# EAGLE design CompletePCBV4 (EAGLE 9.2.1)
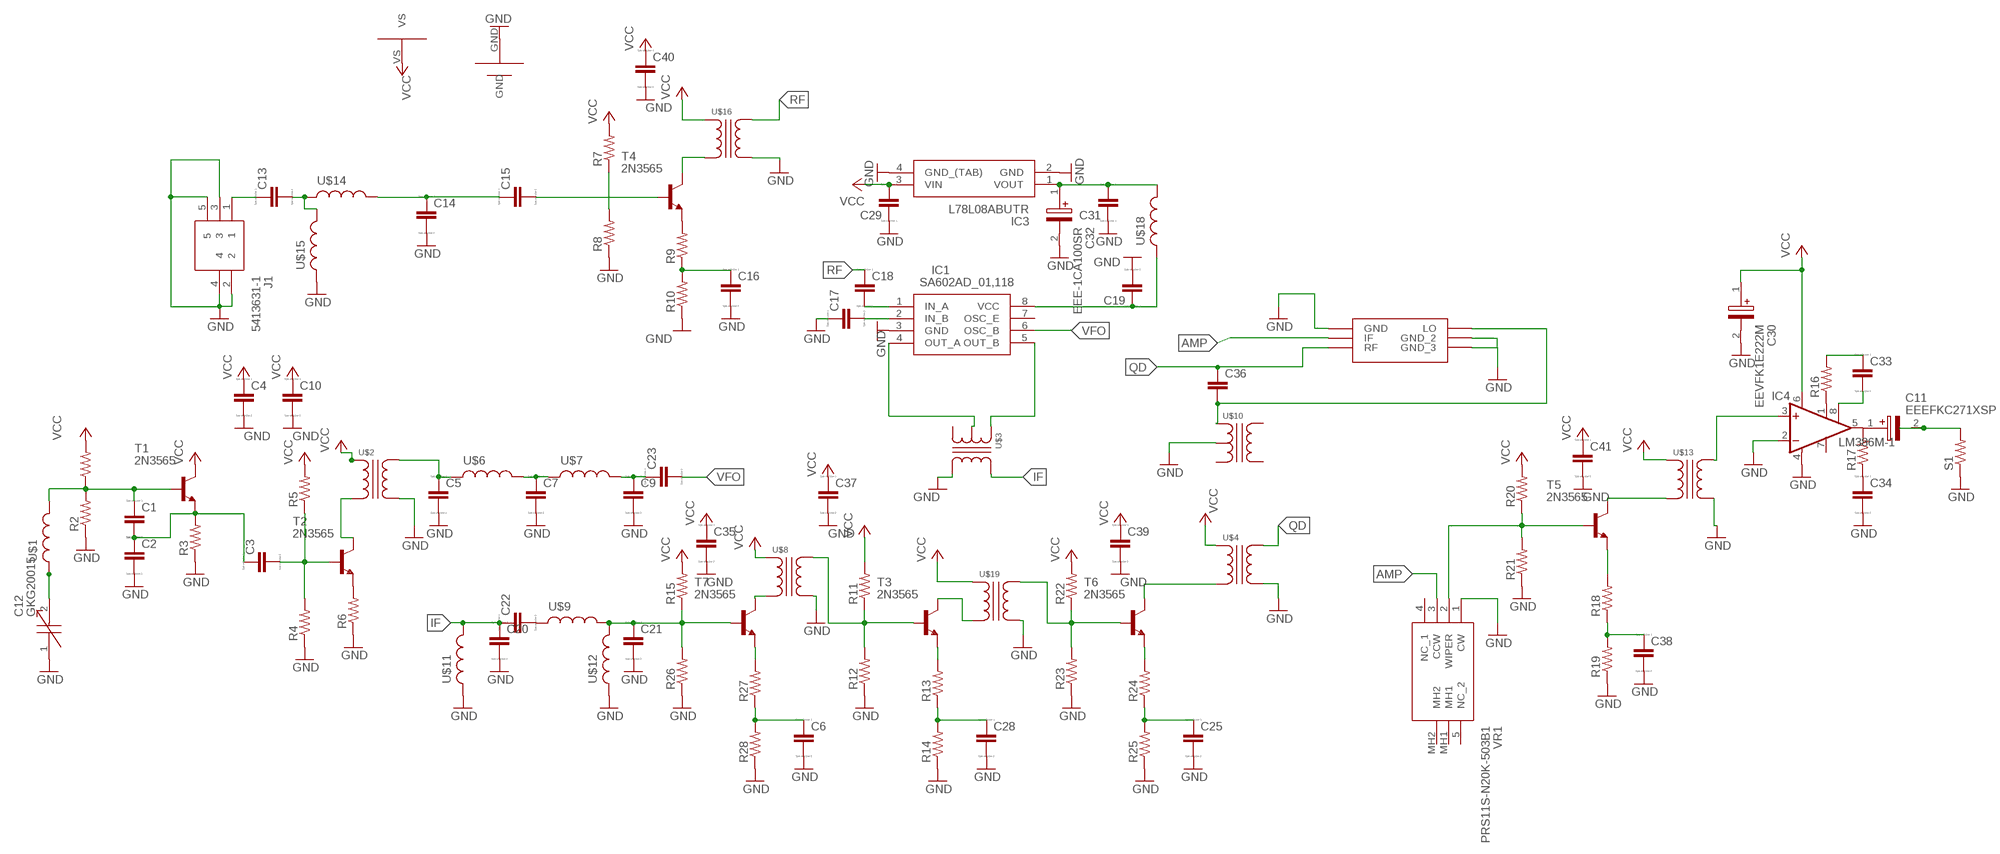
[diagram p0: schematic, sheet 1]

## Parts
C1  C  [C0805]
C2  C  [C0805]
C3  C  [C0805]
C4  C  [C0805]
C5  C  [C0805]
C6  C  [C0805]
C7  C  [C0805]
C9  C  [C0805]
C10  C  [C0805]
C11  EEEFKC271XSP  [FKSV(D8)]
C12  GKG20015  [GKG20015]
C13  C  [C0805]
C14  C  [C0805]
C15  C  [C0805]
C16  C  [C0805]
C17  C  [C0805]
C18  C  [C0805]
C19  C  [C0805]
C20  C  [C0805]
C21  C  [C0805]
C22  C  [C0805]
C23  C  [C0805]
C25  C  [C0805]
C28  C  [C0805]
C29  C  [C0805]
C30  EEVFK1E222M  [FKV(J16)]
C31  C  [C0805]
C32  EEE-1CA100SR  [SV(B)]
C33  C  [C0805]
C34  CC1206  [C1206]
C35  C  [C0805]
C36  C-EUC0805  [C0805]
C37  C  [C0805]
C38  C  [C0805]
C39  C  [C0805]
C40  C  [C0805]
C41  C  [C0805]
IC1  SA602AD_01,118  [SOIC127P600X175-8N]
IC3  L78L08ABUTR  [ST-SOT-89]
IC4  LM386M-1  [SO08]
J1  5413631-1  [54136311]
R1  R-US_R0805  [R0805]
R2  R-US_R0805  [R0805]
R3  R-US_R0805  [R0805]
R4  R-US_R0805  [R0805]
R5  R-US_R0805  [R0805]
R6  R-US_R0805  [R0805]
R7  R-US_R0805  [R0805]
R8  R-US_R0805  [R0805]
R9  R-US_R0805  [R0805]
R10  R-US_R0805  [R0805]
R11  R-US_R0805  [R0805]
R12  R-US_R0805  [R0805]
R13  R-US_R0805  [R0805]
R14  R-US_R0805  [R0805]
R15  R-US_R0805  [R0805]
R16  R-US_R0805  [R0805]
R17  R-US_R0805  [R0805]
R18  R-US_R0805  [R0805]
R19  R-US_R0805  [R0805]
R20  R-US_R0805  [R0805]
R21  R-US_R0805  [R0805]
R22  R-US_R0805  [R0805]
R23  R-US_R0805  [R0805]
R24  R-US_R0805  [R0805]
R25  R-US_R0805  [R0805]
R26  R-US_R0805  [R0805]
R27  R-US_R0805  [R0805]
R28  R-US_R0805  [R0805]
S1  R-US_0207/5V  [0207/5V]
T1  2N3565  [TO92]
T2  2N3565  [TO92]
T3  2N3565  [TO92]
T4  2N3565  [TO92]
T5  2N3565  [TO92]
T6  2N3565  [TO92]
T7  2N3565  [TO92]
U$1  WOUNDINDUCTOR  [WOUNDINDUCTOR]
U$2  RFTRANSFORMER  [RFTRABSFORMER]
U$3  42IF123  [42IF123]
U$4  RFTRANSFORMER  [RFTRABSFORMER]
U$5  ALLIGATORCLIPS  [ALLIGATORCONNECTOR]
U$6  WOUNDINDUCTOR  [WOUNDINDUCTOR]
U$7  WOUNDINDUCTOR  [WOUNDINDUCTOR]
U$8  RFTRANSFORMER  [RFTRABSFORMER]
U$9  WOUNDINDUCTOR  [WOUNDINDUCTOR]
U$10  42IF123  [42IF123]
U$11  WOUNDINDUCTOR  [WOUNDINDUCTOR]
U$12  WOUNDINDUCTOR  [WOUNDINDUCTOR]
U$13  RFTRANSFORMER  [RFTRABSFORMER]
U$14  WOUNDINDUCTOR  [WOUNDINDUCTOR]
U$15  WOUNDINDUCTOR  [WOUNDINDUCTOR]
U$16  RFTRANSFORMER  [RFTRABSFORMER]
U$17  ADE-1  [ADE-1]
U$18  WOUNDINDUCTOR  [WOUNDINDUCTOR]
U$19  RFTRANSFORMER  [RFTRABSFORMER]
VR1  PRS11S-N20K-503B1  [PRS11SN20K503B1]

## Nets
AMP: U$17.IF VR1.3(CCW)
GND: C2.2 C4.2 C5.2 C6.2 C7.2 C9.2 C10.2 C12.1 C14.2 C16.2 C17.1 C19.2 C20.2 C21.2 C25.2 C28.2 C29.1 C30.2(-) C31.1 C32.2(-) C34.2 C35.2 C37.2 C38.2 C39.2 C40.2 C41.2 IC1.3(GND) IC3.2(GND) IC3.4(GND_(TAB)) IC4.2(-IN) IC4.4(GND) J1.2 J1.3 J1.4 J1.5 R2.1 R3.1 R4.1 R6.1 R8.1 R10.1 R12.1 R14.1 R19.1 R21.1 R23.1 R25.1 R26.1 R28.1 S1.1 U$2.P$4 U$3.P$4 U$4.P$4 U$5.GND U$8.P$4 U$10.P$1 U$11.1 U$12.1 U$13.P$4 U$15.1 U$16.P$4 U$17.GND U$17.GND2(GND_2) U$17.GND3(GND_3) U$19.P$4 VR1.1(CW)
IF: C20.1 C22.1 U$3.P$5 U$11.2
N$1: R6.2 T2.3(E)
N$2: T7.1(C) U$8.P$2
N$3: C1.2 C2.1 C3.1 R3.2 T1.3(E)
N$4: C1.1 R1.1 R2.2 T1.2(B) U$1.2
N$5: C3.2 R4.2 R5.1 T2.2(B)
N$6: R22.1 R23.2 T6.2(B) U$19.P$3
N$7: C22.2 U$9.1
N$8: C5.1 U$2.P$3 U$6.1
N$9: R9.2 T4.3(E)
N$10: C7.1 U$6.2 U$7.1
N$11: T2.1(C) U$2.P$2
N$12: C12.2 U$1.1
N$13: C9.1 C23.1 U$7.2
N$14: C16.1 R9.1 R10.2
N$15: C13.1 J1.1
N$16: C14.1 C15.1 U$14.2
N$17: C15.2 T4.2(B)
N$18: R7.1 R8.2
N$19: T4.1(C) U$16.P$2
N$20: IC1.5(OUT_B) U$3.P$2
N$21: IC1.4(OUT_A) U$3.P$1
N$22: C28.1 R13.1 R14.2
N$23: C17.2 IC1.2(IN_B)
N$24: C18.2 IC1.1(IN_A)
N$26: T6.1(C) U$4.P$2
N$27: C36.2 U$10.P$2 U$17.LO
N$28: R20.1 R21.2 T5.2(B) VR1.2(WIPER)
N$29: R18.2 T5.3(E)
N$30: C38.1 R18.1 R19.2
N$31: R11.1 R12.2 T3.2(B) U$8.P$3
N$32: T5.1(C) U$13.P$2
N$33: T3.1(C) U$19.P$2
N$34: C19.1 IC1.8(VCC) U$18.1
N$35: IC4.3(+IN) U$13.P$3
N$36: C13.2 U$14.1 U$15.2
N$37: R24.2 T6.3(E)
N$38: C25.1 R24.1 R25.2
N$39: R13.2 T3.3(E)
N$40: IC4.1(GAIN) R16.1
N$41: C11.1(+) IC4.5(OUT) R17.2
N$42: C34.1 R17.1
N$43: C21.1 R15.1 R26.2 T7.2(B) U$9.2 U$12.2
N$44: C33.1 R16.2
N$45: C33.2 IC4.8(GAIN)
N$46: C11.2(-) S1.2
N$47: C31.2 C32.1(+) IC3.1(VOUT) U$18.2
N$49: C6.1 R27.1 R28.2
N$50: R27.2 T7.3(E)
QD: C36.1 U$4.P$3 U$17.RF
RF: C18.1 U$16.P$3
VCC: C4.1 C10.1 C29.2 C30.1(+) C35.1 C37.1 C39.1 C40.1 C41.1 IC3.3(VIN) IC4.6(VS) R1.2 R5.2 R7.2 R11.2 R15.2 R20.2 R22.2 T1.1(C) U$2.P$1 U$4.P$1 U$5.VS U$8.P$1 U$13.P$1 U$16.P$1 U$19.P$1
VFO: C23.2 IC1.6(OSC_B)
Unconnected: IC1.7(OSC_E) IC4.7(BYPASS) U$3.P$3 U$10.P$3 U$10.P$4 U$10.P$5 VR1.4(NC_1) VR1.5(NC_2) VR1.MH1 VR1.MH2

## Library data of the parts
C1-C7 C9 C10 C13-C23 C25 C28 C29 C31 C33-C35 C37-C41 = eagle-ltspice:C: CAPACITOR, European symbol; SPICEMODEL: NONE; SPICEPREFIX: C
C11 = SamacSys_Parts:EEEFKC271XSP: Panasonic 270uF 16 V dc Aluminium Electrolytic Capacitor, FKS Series 2000h 6.3 (Dia.) x 7.7mm Source: Datasheet <https://industrial.panasonic.com/cdbs/www-data/pdf/RDE0000/ABA0000C569.pdf>; DESCRIPTION: Panasonic 270uF 16 V dc Aluminium Electrolytic Capacitor, FKS Series 2000h 6.3 (Dia.) x 7.7mm; HEIGHT: mm; MANUFACTURER_NAME: Panasonic; MANUFACTURER_PART_NUMBER: EEEFKC271XSP
C12 = SamacSys_Parts:GKG20015: Trimmer / Variable Capacitors 5-20pF 100V 85 DEG Source: Datasheet <http://www.mouser.com/datasheet/2/384/659305J-1204018.pdf>; DESCRIPTION: Trimmer / Variable Capacitors 5-20pF 100V 85 DEG; HEIGHT: 5.1mm; MANUFACTURER_NAME: Sprague Goodman; MANUFACTURER_PART_NUMBER: GKG20015; MOUSER_PART_NUMBER: 659-GKG20015; MOUSER_PRICE-STOCK: https://www.mouser.com/Search/Refine.aspx?Keyword=659-GKG20015
C30 = SamacSys_Parts:EEVFK1E222M: Ecap 2200uF 25V J16 Case FK SMD Panasonic Aluminium Electrolytic Capacitor 2200uF 25 V dc 16mm Surface Mount series FK SMD lifetime 5000h Source: Datasheet <https://industrial.panasonic.com/cdbs/www-data/pdf/RDE0000/ABA0000C1181.pdf>; DESCRIPTION: Ecap 2200uF 25V J16 Case FK SMD Panasonic Aluminium Electrolytic Capacitor 2200uF 25 V dc 16mm Surface Mount series FK SMD lifetime 5000h; HEIGHT: mm; MANUFACTURER_NAME: Panasonic; MANUFACTURER_PART_NUMBER: EEVFK1E222M
C32 = SamacSys_Parts:EEE-1CA100SR: Aluminum Electrolytic Capacitors - SMD 10uF 16V Source: Datasheet <https://componentsearchengine.com/Datasheets/1/EEE-1CA100SR.pdf>; DESCRIPTION: Aluminum Electrolytic Capacitors - SMD 10uF 16V; HEIGHT: mm; MANUFACTURER_NAME: Panasonic; MANUFACTURER_PART_NUMBER: EEE-1CA100SR; MOUSER_PART_NUMBER: 667-EEE-1CA100SR; MOUSER_PRICE-STOCK: https://www.mouser.com/Search/Refine.aspx?Keyword=667-EEE-1CA100SR
C36 = rcl:C-EU: CAPACITOR, European symbol; SPICEPREFIX: C
IC1 = SamacSys_Parts:SA602AD_01,118: NXP - SA602AD/01,118 - DOUBLE-BALANCED MIXER, 500MHZ, SOIC-8 Source: Datasheet <https://www.mouser.com/datasheet/2/302/SA602A-1127653.pdf>; DESCRIPTION: NXP - SA602AD/01,118 - DOUBLE-BALANCED MIXER, 500MHZ, SOIC-8; HEIGHT: 1.75mm; MANUFACTURER_NAME: NXP; MANUFACTURER_PART_NUMBER: SA602AD/01,118; MOUSER_PART_NUMBER: 771-SA602AD/01-T
IC3 = SamacSys_Parts:L78L08ABUTR: L78L08ABUTR, Voltage Regulator, 0.1A 8 V, 4-Pin SOT-89 Source: Datasheet <https://componentsearchengine.com/Datasheets/1/L78L08ABUTR.pdf>; DESCRIPTION: L78L08ABUTR, Voltage Regulator, 0.1A 8 V, 4-Pin SOT-89; HEIGHT: mm; MANUFACTURER_NAME: STMicroelectronics; MANUFACTURER_PART_NUMBER: L78L08ABUTR; MOUSER_PART_NUMBER: 511-L78L08ABU; MOUSER_PRICE-STOCK: https://www.mouser.com/Search/Refine.aspx?Keyword=511-L78L08ABU
IC4 = linear:LM386?-*: Low Voltage Audio Power Amplifier Source: http://cache.national.com/ds/LM/LM386.pdf
J1 = SamacSys_Parts:5413631-1: TE Connectivity Right Angle 50 Through Hole BNC Connector, jack, Nickel, Solder Termination Source: Datasheet <https://componentsearchengine.com/Datasheets/1/5413631-1.pdf>; DESCRIPTION: TE Connectivity Right Angle 50 Through Hole BNC Connector, jack, Nickel, Solder Termination; HEIGHT: 11.15mm; MANUFACTURER_NAME: TE Connectivity; MANUFACTURER_PART_NUMBER: 5413631-1; MOUSER_PART_NUMBER: 571-5413631-1; MOUSER_PRICE-STOCK: https://www.mouser.com/Search/Refine.aspx?Keyword=571-5413631-1
R1-R28 = resistor:R-US_: RESISTOR, American symbol
S1 = rcl:R-US_: RESISTOR, American symbol; SPICEPREFIX: R
T1-T7 = transistor:2N3565: NPN TRANSISTOR
U$1 U$6 U$7 U$9 U$11 U$12 U$14 U$15 U$18 = Custom:WOUNDINDUCTOR
U$2 U$4 U$8 U$13 U$16 U$19 = Custom:RFTRANSFORMER
U$3 U$10 = Custom:42IF123
U$5 = Custom:ALLIGATORCLIPS
U$17 = Custom:ADE-1
VR1 = SamacSys_Parts:PRS11S-N20K-503B1: Res Carbon Film POT 50K Ohm 20% 0.05W(1/20W) 1(Elec)/1(Mech)Turn 6mm (11.7 X 18.5 X 21.4mm) Gull Wing SMD Tube Source: Datasheet <https://componentsearchengine.com/Datasheets/1/PRS11S-N20K-503B1.pdf>; DESCRIPTION: Res Carbon Film POT 50K Ohm 20% 0.05W(1/20W) 1(Elec)/1(Mech)Turn 6mm (11.7 X 18.5 X 21.4mm) Gull Wing SMD Tube; HEIGHT: 20mm; MANUFACTURER_NAME: Bourns; MANUFACTURER_PART_NUMBER: PRS11S-N20K-503B1; MOUSER_PART_NUMBER: 652-PRS11SN20K503B1; MOUSER_PRICE-STOCK: https://www.mouser.com/Search/Refine.aspx?Keyword=652-PRS11SN20K503B1

## Net classes
0 default: width 0.762 mm
1 POWER: width 0.381 mm
2 RF: width 0.635 mm
3 VCC: width 0.889 mm

## Board
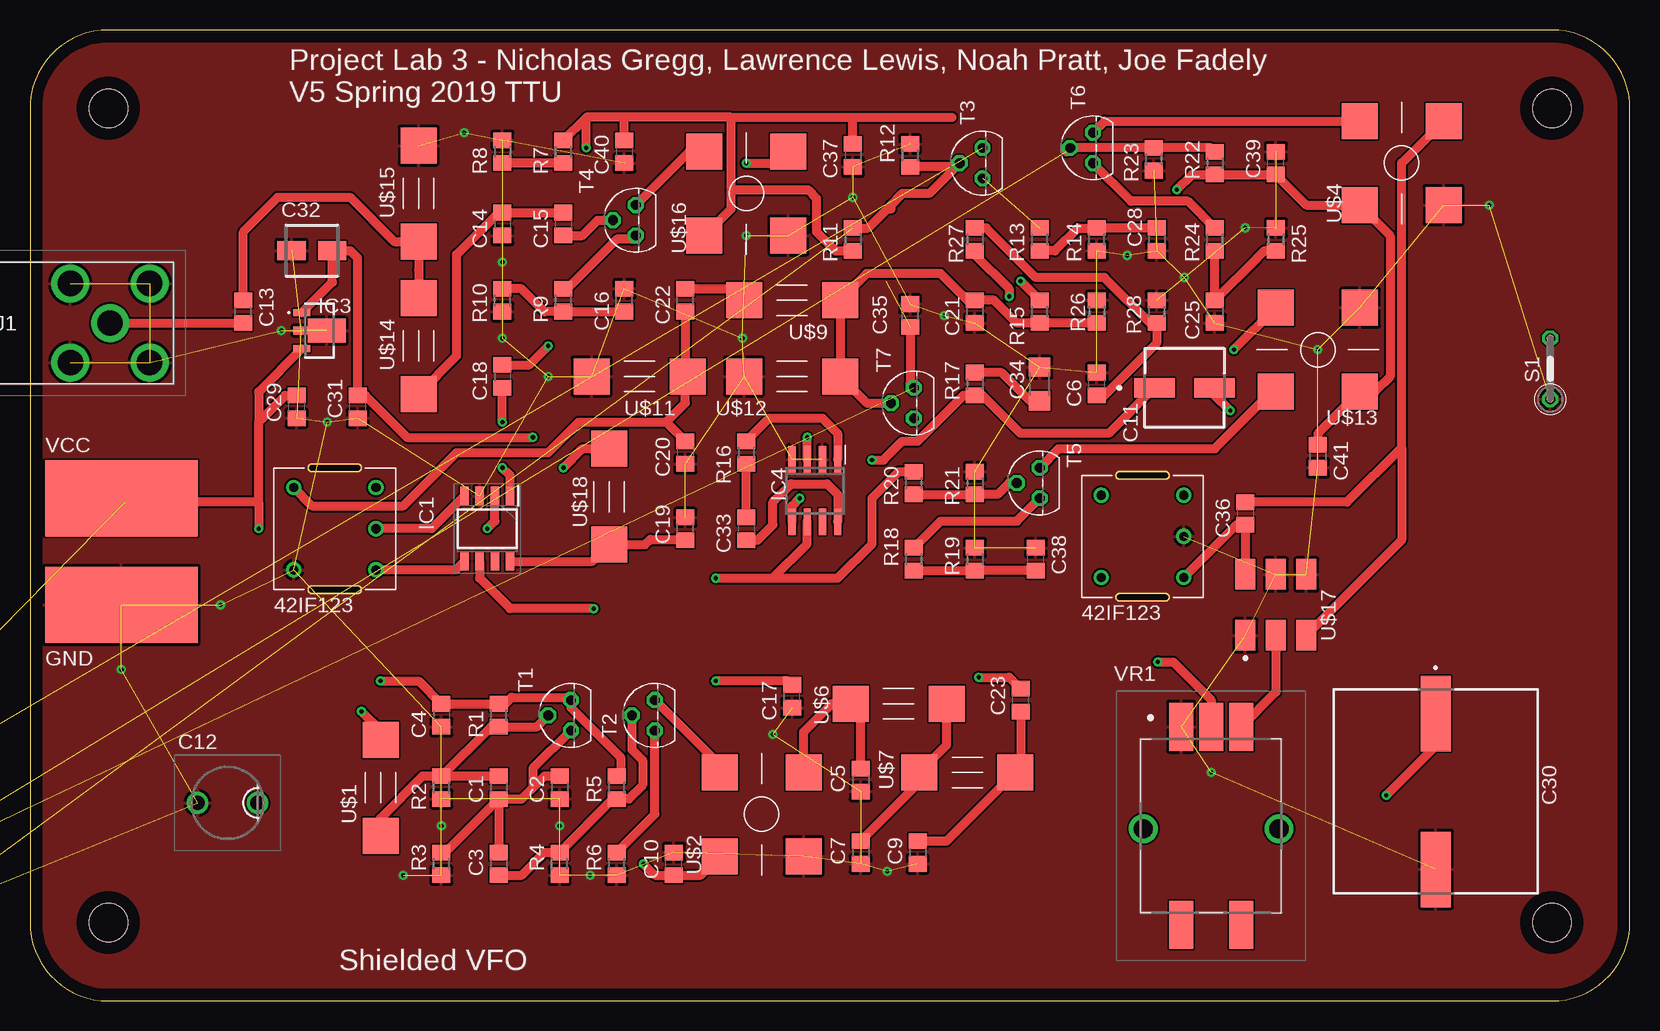
[diagram p1: board, top side]
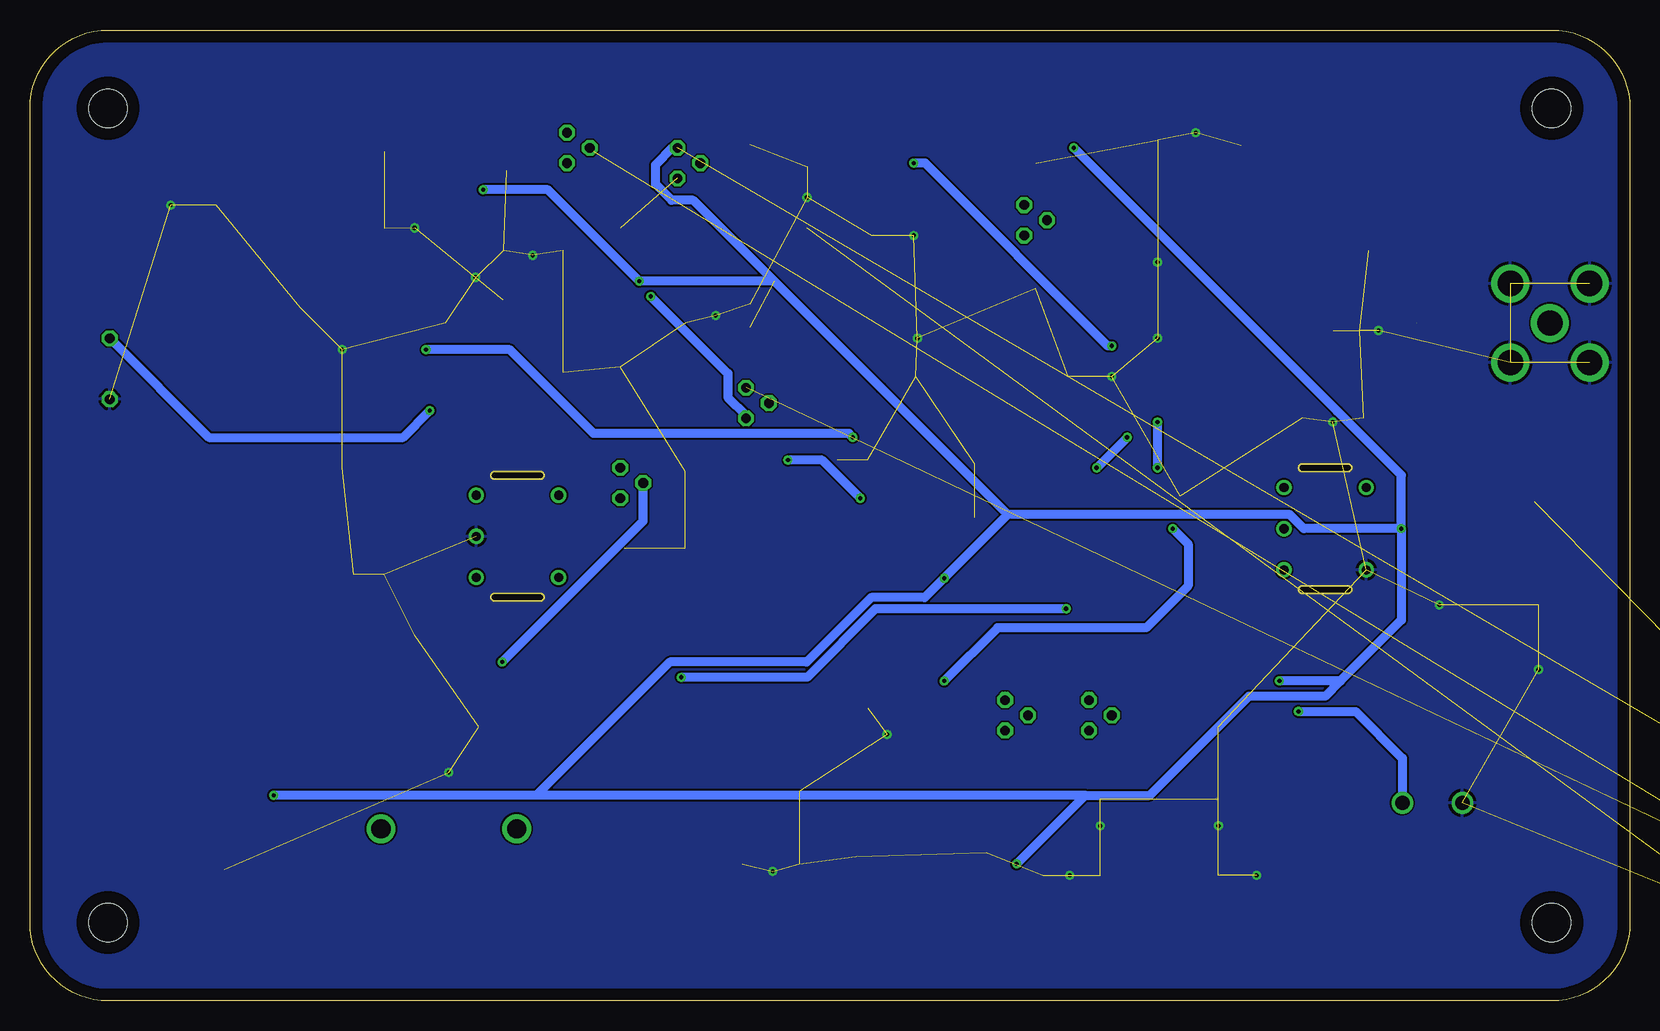
[diagram p2: board, bottom side, seen from below]

Size 133.33 x 80.95 mm. Coordinates in mm from the lower left corner, seen from the top.
Outline: 0,74.42 0,6.53 arc90 6.53,0 126.8,0 arc90 133.33,6.53 133.33,74.42 arc90 126.8,80.95 6.53,80.95 arc90 0,74.42
Copper layers (1*16): Top 0.035mm / dielectric 1.5mm / Bottom 0.035mm
Design rules "default": minimum track width 6mil, minimum drill 0.35mm, track to track 6mil, track to pad 6mil, pad to pad 6mil, via to via 6mil, smd to smd 6mil, copper to edge 40mil, drill to drill 6mil, minimum pad ring 10mil, minimum via ring 8mil, stop-mask expansion 4mil, vias tented up to drill 0mil, thermal gap 10mil
Holes 3.2 mm at 6.53,74.42 126.82,74.42 126.82,6.53 6.53,6.53

### Footprints (pad centres in the part's own frame; a part is rotated, then mirrored left to right if it is on the bottom)
C0805 = smd 1.3 x 1.5: 1 -0.95,0; 2 0.95,0
FKSV(D8) = smd 3.4 x 1.6: 1 -2.5,0; 2 2.5,0
GKG20015 = drill 1.2 pad 1.8: 1 0,0; 2 5,0
FKV(J16) = smd 6.3 x 2.5: 1 -6.5,0; 2 6.5,0
SV(B) = smd 2.35 x 1.6: 1 -1.7,0; 2 1.7,0
C1206 = smd 1.6 x 1.8: 1 -1.4,0; 2 1.4,0
SOIC127P600X175-8N = smd 1.55 x 0.7: 1 -2.725,1.905; 2 -2.725,0.635; 3 -2.725,-0.635; 4 -2.725,-1.905; 5 2.725,-1.905; 6 2.725,-0.635; 7 2.725,0.635; 8 2.725,1.905
ST-SOT-89 = smd 0.57 x 1.4: 1 -1.5,-1.475; 3 1.5,-1.475 | smd 0.65 x 1.2: 2 0,-1.575 | smd 2 x 3.15: 4 0,0.6
SO08 = smd 0.6 x 2.2: 1 -1.905,-2.6; 2 -0.635,-2.6; 3 0.635,-2.6; 4 1.905,-2.6; 5 1.905,2.6; 6 0.635,2.6; 7 -0.635,2.6; 8 -1.905,2.6
54136311 = drill 2.11 pad 3.165: 1 0,0; 2 -3.3,3.3; 3 -3.3,-3.3; 4 3.3,-3.3; 5 3.3,3.3
R0805 = smd 1.3 x 1.5: 1 -0.95,0; 2 0.95,0
0207/5V = drill 0.813 octagon: 1 -2.54,0; 2 2.54,0
TO92 = drill 0.813 octagon: 1 1.27,0; 2 0,1.905; 3 -1.27,0
WOUNDINDUCTOR = smd 3 x 3: 1 0,4; 2 0,-4
RFTRABSFORMER = smd 3 x 3: P$1 -3.5,3.5; P$2 3.5,3.5; P$3 3.5,-3.5; P$4 -3.5,-3.5
42IF123 = drill 0.762: P$1 -3.429,0; P$2 -3.429,3.429; P$3 -3.429,-3.429; P$4 3.429,3.429; P$5 3.429,-3.429
ALLIGATORCONNECTOR = smd 6.35 x 12.7: GND 7.62,2.54; VS -1.27,2.54
ADE-1 = smd 1.65 x 2.54: GND -2.54,-2.54; GND2 0,2.54; GND3 2.54,2.54; IF 0,-2.54; LO -2.54,2.54; RF 2.54,-2.54
PRS11SN20K503B1 = smd 2 x 4: 1 2.5,-8.25; 2 0,-8.25; 3 -2.5,-8.25; 4 -2.5,8.25; 5 2.5,8.25 | drill 1.6 pad 2.4: MH1 -5.65,0.25; MH2 5.65,0.25

### Placement (x,y rotation side)
C1  39.05,17.78 270 top
C2  44.13,17.78 270 top
C3  39.05,11.43 270 top
C4  34.29,23.81 270 top
C5  69.22,18.41 270 top
C6  88.9,51.44 90 top
C7  69.22,12.38 270 top
C9  73.98,12.38 270 top
C10  53.66,11.43 90 top
C11  96.2,51.12 0 top
C12  13.97,16.51 0 top
C13  17.78,57.47 90 top
C14  39.37,64.77 270 top
C15  44.45,64.77 270 top
C16  49.53,58.42 90 top
C17  63.5,25.4 90 top
C18  39.37,52.07 270 top
C19  54.61,39.37 90 top
C20  54.61,45.72 270 top
C21  78.74,57.47 270 top
C22  54.61,58.42 90 top
C23  82.55,25.08 90 top
C25  98.74,57.47 270 top
C28  93.88,63.5 270 top
C29  22.23,49.53 90 top
C30  117.16,17.46 270 top
C31  27.3,49.53 90 top
C32  23.5,62.55 180 top
C33  59.69,39.37 270 top
C34  84.14,51.44 90 top
C35  73.34,57.15 90 top
C36  101.28,40.64 270 top
C37  68.58,70.48 270 top
C38  83.82,36.83 90 top
C39  103.82,69.85 90 top
C40  49.53,70.8 270 top
C41  107.31,45.4 270 top
IC1  38.1,39.37 270 top
IC3  24.13,55.88 270 top
IC4  65.41,42.55 180 top
J1  6.67,56.52 0 top
R1  39.05,23.81 90 top
R2  34.29,17.78 90 top
R3  34.29,11.43 90 top
R4  44.13,11.43 90 top
R5  48.9,17.78 90 top
R6  48.9,11.43 90 top
R7  44.45,70.8 90 top
R8  39.37,70.8 270 top
R9  44.45,58.42 90 top
R10  39.37,58.42 90 top
R11  68.58,63.5 270 top
R12  73.34,70.48 270 top
R13  84.14,63.5 90 top
R14  88.9,63.5 90 top
R15  84.14,57.47 90 top
R16  59.69,45.72 270 top
R17  78.74,51.44 270 top
R18  73.66,36.83 90 top
R19  78.74,36.83 270 top
R20  73.66,43.18 90 top
R21  78.74,43.18 270 top
R22  98.74,69.85 270 top
R23  93.66,70.17 90 top
R24  98.74,63.5 90 top
R25  103.82,63.5 270 top
R26  88.9,57.47 270 top
R27  78.74,63.5 270 top
R28  93.88,57.47 270 top
S1  126.68,52.7 90 top
T1  45.09,23.81 90 top
T2  52.07,23.81 90 top
T3  79.38,69.85 90 top
T4  50.48,65.09 90 top
T5  84.14,43.18 90 top
T6  88.58,71.12 90 top
T7  73.66,49.85 90 top
U$1  29.21,17.78 0 top
U$2  60.96,15.56 90 top
U$3  25.4,39.37 180 top
U$4  114.3,69.85 90 top
U$5  5.08,40.64 270 top
U$6  72.39,24.77 90 top
U$7  78.11,19.05 90 top
U$8  -22.23,3.81 0 top  (outside the outline)
U$9  63.5,58.42 90 top
U$10  92.71,38.73 180 top
U$11  50.8,52.07 90 top
U$12  63.5,52.07 90 top
U$13  107.31,54.29 180 top
U$14  32.38,54.61 0 top
U$15  32.38,67.31 0 top
U$16  59.69,67.31 90 top
U$17  103.82,33.02 0 top
U$18  48.26,42.04 180 top
U$19  -33.02,3.81 0 top  (outside the outline)
VR1  98.42,14.61 180 top

### Tracks (layer width: path | path; a pad name or v marks a point on that pad's centre or on a via)
AMP
  Top 0.762: U$17.IF 103.82,25.75 VR1.3
GND  (via drill 0.35)  (90 unrouted)
  other vias: 7.62,27.62 15.88,33.02 20.95,55.88 24.77,48.26 31.11,10.48 34.29,14.61 36.2,72.39 39.37,61.59 39.37,55.24 43.18,52.07 44.13,14.61 46.67,10.48 59.69,63.82 59.37,55.24 61.91,22.23 71.44,10.79 76.2,57.15 91.44,62.16 96.2,60.33 101.28,64.45 121.6,66.36 107.31,54.29 98.42,19.05 68.58,66.99
  pour Top: 0,80.01 134.62,80.01 134.62,-1.27 0,-1.27
  pour Bottom: 0,80.01 134.62,80.01 134.62,-1.27 6.53,-1.27 arc-90 0,5.26
HOLE
  cutout Top: 90.81,44.13 94.61,44.13 arc-90 94.93,43.81 arc-90 94.61,43.5 90.81,43.5 arc-180
HOLE1
  cutout Top: 90.81,33.97 94.61,33.97 arc-90 94.93,33.66 arc-90 94.61,33.34 90.81,33.34 arc-180
HOLE2
  cutout Top: 23.5,44.77 27.3,44.77 arc-90 27.62,44.45 arc-90 27.3,44.13 23.5,44.13 arc-180
HOLE3
  cutout Top: 23.5,34.61 27.3,34.61 arc-90 27.62,34.29 arc-90 27.3,33.97 23.5,33.97 arc-180
IF
  Top 0.762: 53.02,48.26 C20.1 | 53.02,48.26 45.72,48.26 43.18,45.72 35.56,45.72 31.11,41.27 23.5,41.27 U$3.P$5 | C22.1 54.61,52.26 | 54.61,52.26 U$11.2 | 53.02,48.26 54.61,49.85 54.61,52.26
N$1
  Top 0.762: R6.2 52.07,15.55 T2.3
N$2  (1 unrouted)
N$3
  Top 0.762: C1.2 34.6,12.38 R3.2 | C1.2 C3.1 | C1.2 40.96,16.83 41.91,17.78 | T1.3 41.91,19.37 41.91,17.78 | C2.1 42.86,18.73 41.91,17.78
N$4
  Top 0.762: R2.2 38.42,22.86 R1.1 42.23,22.86 T1.2 | R2.2 32.7,18.73 29.21,15.24 U$1.2 | C1.1 R2.2
N$5
  Top 0.762: C3.2 40.96,10.48 42.86,12.38 R4.2 48.58,16.83 R5.1 49.91,16.83 51.05,17.97 51.05,20.07 50.16,20.95 T2.2
N$6  (1 unrouted)
  Top 0.762: R22.1 98.42,71.12 R23.2 86.78,71.12 86.73,71.07 T6.2 86.36,70.8
N$7
  Top 0.762: C22.2 58.55,59.37 U$9.1
N$8
  Top 0.762: U$2.P$3 64.46,22.42 66.8,24.77 U$6.1 | U$6.1 68.58,24.95 | U$6.1 69.22,23.94 C5.1
N$9
  Top 0.762: R9.2 44.77,59.37 48.9,63.5 50.16,63.5 T4.3
N$10
  Top 0.762: C7.1 74.29,18.41 74.29,19.05 U$7.1 76.39,21.34 U$6.2
N$11
  Top 0.762: U$2.P$2 57.46,19.69 T2.1
N$12  (via drill 0.35)
  Top 0.762: v27.62,24.13 29.21,22.54 U$1.1
  Bottom 0.762: v27.62,24.13 22.86,24.13 18.97,20.24 C12.2
N$13
  Top 0.762: C9.1 76.39,13.33 U$7.2 82.55,19.5 C23.1
N$14
  Top 0.762: C16.1 R9.1 42.86,57.47 40.96,59.37 R10.2
N$15  (1 unrouted)
  Top 0.762: C13.1 J1.1
N$16
  Top 0.762: U$14.2 35.56,53.78 35.56,62.23 39.05,65.72 C14.1 C15.1
N$17
  Top 0.762: C15.2 46.04,63.82 47.31,65.09 T4.2
N$18
  Top 0.762: R7.1 R8.2
N$19
  Top 0.762: T4.1 54.94,70.81 U$16.P$2
N$20
  Top 0.762: IC1.5 35.49,35.94 U$3.P$2
N$21
  Top 0.762: IC1.4 33.47,39.37 U$3.P$1
N$22
  Top 0.762: R13.1 85.41,62.55 87.31,64.45 R14.2 C28.1
N$23  (via drill 0.35)
  Top 0.762: C17.2 63.18,26.67 v57.15,26.67 | v38.1,39.37 38.73,40.01 IC1.2
  Bottom 0.762: v57.15,26.67 52.7,31.11 40.32,31.11 36.83,34.61 36.83,38.1 v38.1,39.37
N$24  (via drill 0.35)
  Top 0.762: IC1.1 40.01,43.81 v39.37,44.45 | v39.37,48.26 C18.2
  Bottom 0.762: v39.37,44.45 v39.37,48.26
N$26
  Top 0.762: T6.1 89.54,73.35 U$4.P$2
N$27
  Top 0.762: 96.2,35.24 U$10.P$2 100.52,39.69 C36.2 U$17.LO
N$28  (via drill 0.35)
  Top 0.762: v93.98,28.26 95.25,28.26 98.42,25.08 VR1.2 | T5.2 81.6,43.18 80.64,42.23 R21.2 | R21.2 | R20.1 R21.2
  Bottom 0.762: v93.98,28.26 82.23,40.01 T5.2
N$29
  Top 0.762: R18.2 75.89,40.01 82.23,40.01 T5.3
N$30
  Top 0.762: C38.1 R19.2 R18.1
N$31  (1 unrouted)
  Top 0.762: R12.2 77.16,69.53 T3.2 74.93,67.31 72.71,67.31 71.75,66.36 | R11.1 69.85,64.45 71.75,66.36 | 71.75,66.04 71.75,66.36
N$32
  Top 0.762: T5.1 85.72,46.04 98.74,46.04 103.5,50.79 U$13.P$2
N$33  (1 unrouted)
N$34
  Top 0.762: IC1.8 46.87,36.65 U$18.1 51.24,38.04 51.69,38.48 54.55,38.48 C19.1
N$35  (via drill 0.35)
  Top 0.762: IC4.3 v64.77,46.99 | v100.33,54.29 103.81,57.78 U$13.P$3
  Bottom 0.762: v100.33,54.29 93.34,54.29 86.36,47.31 65.09,47.31 v64.77,46.99
N$36
  Top 0.762: C13.2 17.78,64.14 20.64,66.99 26.67,66.99 30.35,63.31 U$15.2 32.38,60.96 U$14.1
N$37
  Top 0.762: R24.2 96.52,66.67 91.76,66.67 T6.3
N$38
  Top 0.762: R24.1 C25.1 102.23,61.91 102.87,62.55 R25.2
N$39  (1 unrouted)
  Top 0.762: T3.3 79.38,68.9
N$40
  Top 0.762: R16.1 61.6,48.58 66.04,48.58 67.31,47.31 IC4.1
N$41  (via drill 0.35)
  Top 0.762: IC4.5 63.5,41.27 v64.14,41.91 | v70.17,45.09 71.12,45.09 72.71,46.67 73.97,46.67 77.79,50.48 R17.2 79.38,50.48 82.55,47.31 89.89,47.31 C11.1
  Bottom 0.762: v64.14,41.91 67.31,45.09 v70.17,45.09
N$42
  Top 0.762: C34.1 83.31,50.03 80.96,52.38 R17.1
N$43
  Top 0.762: T7.2 69.72,49.85 U$12.2 U$9.2 69.72,60.64 75.88,60.64 78.11,58.42 C21.1 80.33,58.42 82.23,56.52 R15.1 R26.2
N$44
  Top 0.762: C33.1 R16.2
N$45
  Top 0.762: C33.2 60.65,38.42 61.91,39.69 61.91,41.59 63.44,43.12 66.42,43.12 67.31,42.23 IC4.8
N$46  (via drill 0.35)
  Top 0.762: C11.2 98.7,50.52 v100.01,49.21
  Bottom 0.762: v100.01,49.21 102.23,46.99 118.43,46.99 S1.2
N$47  (via drill 0.35)
  Top 0.762: v41.91,46.99 31.43,46.99 27.94,50.48 C31.2 27.3,61.93 26.69,62.55 C32.1 25.2,59.92 IC3.1 | v44.45,44.45 46.04,46.04 U$18.2
  Bottom 0.762: v41.91,46.99 v44.45,44.45
N$49
  Top 0.762: R27.1 79.69,64.45 83.82,60.32 89.54,60.32 93.34,56.52 R28.2 93.89,54.84 89.53,50.48 C6.1
N$50  (via drill 0.35)
  Top 0.762: R27.2 78.74,62.23 81.6,59.38 v81.6,58.74
  Bottom 0.762: v81.6,58.74 75.17,52.31 75.17,50.31 73.66,48.79 T7.3
PORT
  cutout Bottom: 90.49,43.81 arc-90 90.81,44.13 94.61,44.13 arc-90 94.93,43.81 arc-90 94.61,43.5 90.81,43.5 arc-90
PORT1
  cutout Bottom: 90.49,33.66 arc-90 90.81,33.97 94.61,33.97 arc-90 94.93,33.66 arc-90 94.61,33.34 90.81,33.34 arc-90
PORT2
  cutout Bottom: 23.18,44.45 arc-90 23.5,44.77 27.3,44.77 arc-90 27.62,44.45 arc-90 27.3,44.13 23.5,44.13 arc-90
PORT3
  cutout Bottom: 23.18,34.29 arc-90 23.5,34.61 27.3,34.61 arc-90 27.62,34.29 arc-90 27.3,33.97 23.5,33.97 arc-90
QD
  Top 0.762: 114.3,46.15 114.3,69.85 116.84,72.39 118.11,72.39 118.11,73.04 U$4.P$3 | 114.3,46.15 114.3,38.42 U$17.RF | C36.1 109.74,41.59 114.3,46.15
RF  (via drill 0.35)
  Top 0.762: C18.1 41.59,53.02 v43.18,54.61 | v59.69,69.85 62.23,69.85 U$16.P$3
  Bottom 0.762: v43.18,54.61 43.5,54.61 58.74,69.85 v59.69,69.85
VCC  (via drill 0.35)  (3 unrouted)
  Top 0.762: C29.2 21.27,50.48 19.05,48.26 | 19.05,41.59 v19.05,39.37 | R5.2 49.21,19.05 49.21,20.32 45.09,24.45 T1.1 44.84,25.32 40.15,25.32 39.58,24.76 R1.2 C4.1 32.38,26.67 v29.21,26.67 | IC3.3 19.05,50.77 19.05,48.26 | U$16.P$1 58.42,66.04 58.42,67.63 | 58.42,67.63 58.42,73.66 | 58.42,73.66 49.53,73.66 | 49.53,73.66 46.36,73.66 46.35,73.66 | 46.35,73.66 R7.2 | 58.42,67.63 64.83,67.63 65.53,66.93 65.53,64.14 67.12,62.55 R11.2 | v57.15,35.24 61.91,35.24 | 61.91,35.24 64.77,38.1 IC4.6 | 58.42,73.66 68.58,73.66 | 68.58,73.66 76.83,73.66 | 61.91,35.24 67.31,35.24 70.17,38.1 70.17,41.91 72.39,44.13 R20.2 | R15.2 v82.55,60.01 | v95.57,67.63 96.84,68.9 R22.2 C39.1 106.37,66.35 U$4.P$1 113.35,63.8 113.35,52.07 112.07,50.79 U$13.P$1 107.31,47.29 C41.1 | 19.05,41.59 7.94,41.59 U$5.VS | v113.03,17.14 117.16,21.27 C30.1 | 19.05,41.59 19.05,48.26 | v51.12,11.43 52.07,10.48 C10.1 55.88,10.48 U$2.P$1 | C35.1 73.34,51.44 | C37.1 68.58,73.66 | C40.1 49.53,73.66 | v46.35,71.12 46.35,73.66
  Bottom 0.762: v19.05,39.37 19.05,31.75 24.13,26.67 | 24.13,26.67 v29.21,26.67 | 24.13,26.67 25.4,25.4 31.75,25.4 40.01,17.14 45.4,17.14 | 45.4,17.14 v51.12,11.43 | v19.05,39.37 27.18,39.37 28.34,40.54 51.85,40.54 | 51.85,40.54 v57.15,35.24 58.78,33.62 63.24,33.62 68.6,28.26 80.01,28.26 91.12,17.14 | 51.85,40.54 62.43,51.12 71.32,60.01 | v95.57,67.63 90.17,67.63 v82.55,60.01 71.32,60.01 | 45.4,17.14 91.12,17.14 | 91.12,17.14 v113.03,17.14 | 71.32,60.01 78.07,66.75 79.87,66.75 81.2,68.09 81.2,69.71 79.79,71.12 | v46.35,71.12 24.41,49.17 24.39,49.17 19.05,43.83 v19.05,39.37
VFO  (via drill 0.35)
  Top 0.762: v46.99,32.7 40.01,32.7 37.47,35.24 IC1.6 | v79.06,26.99 81.59,26.99 C23.2
  Bottom 0.762: v46.99,32.7 62.87,32.7 68.58,26.99 v79.06,26.99

### Text on the board
tNames: Project Lab 3 - Nicholas Gregg, Lawrence Lewis, Noah Pratt, Joe Fadely / V5 Spring 2019 TTU | Shielded VFO